# Altium schematic sheet Strain Gauge ADC.SchDoc: SG ADC
size Letter; Date: Jul 31/2018; Revision: 1; SheetNumber: 5; SheetTotal: 9
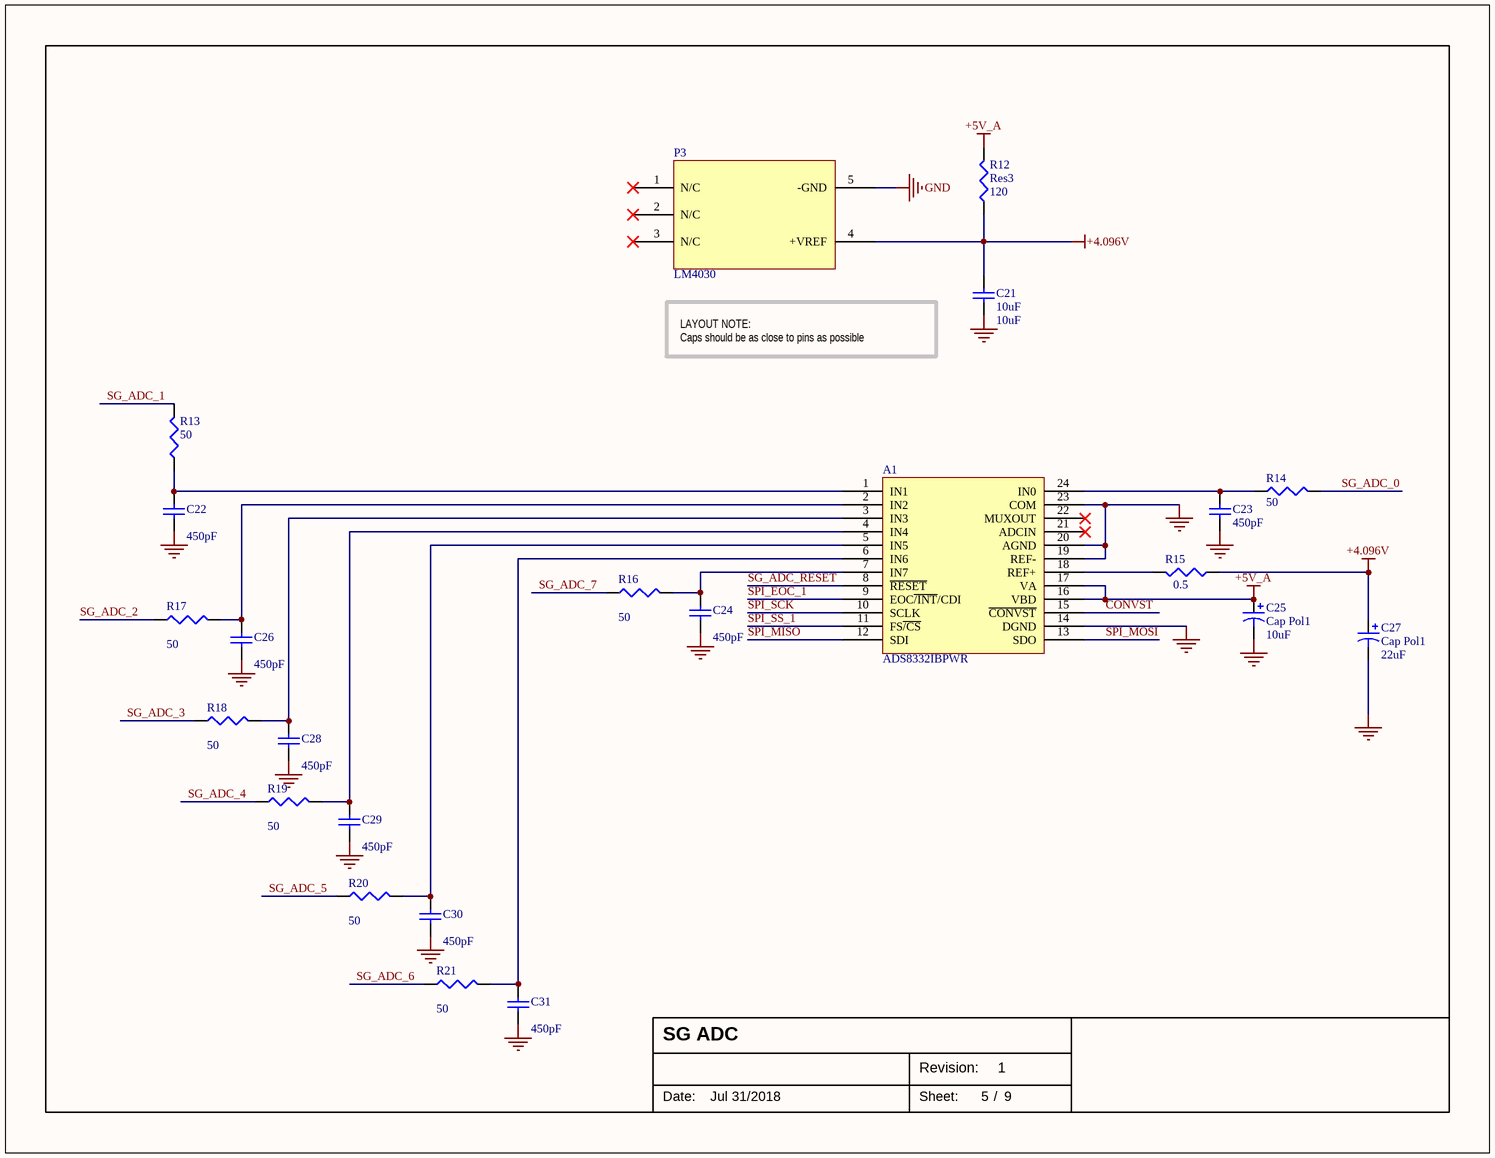
[diagram p0: Strain Gauge ADC.SchDoc]

## Parts
A1  ADS8332IBPWR  [TSSOP-24]
C21  10uF  [1206]
C22  value 450pF  [1206]  (hidden comment: Cap Semi)
C23  value 450pF  [1206]  (hidden comment: Cap Semi)
C24  value 450pF  [1206]  (hidden comment: Cap Semi)
C25  Cap Pol1  value 10uF  [1206-Polarized]
C26  value 450pF  [1206]  (hidden comment: Cap Semi)
C27  Cap Pol1  value 22uF  [1206-Polarized]
C28  value 450pF  [1206]  (hidden comment: Cap Semi)
C29  value 450pF  [1206]  (hidden comment: Cap Semi)
C30  value 450pF  [1206]  (hidden comment: Cap Semi)
C31  value 450pF  [1206]  (hidden comment: Cap Semi)
P3  LM4030  [so-23]
R12  Res3  value 120  [1206]
R13  value 50  [1206]  (hidden comment: Res3)
R14  value 50  [1206]  (hidden comment: Res3)
R15  value 0.5  [1206]  (hidden comment: Res3)
R16  value 50  [1206]  (hidden comment: Res3)
R17  value 50  [1206]  (hidden comment: Res3)
R18  value 50  [1206]  (hidden comment: Res3)
R19  value 50  [1206]  (hidden comment: Res3)
R20  value 50  [1206]  (hidden comment: Res3)
R21  value 50  [1206]  (hidden comment: Res3)

## Nets
+4.096V: C21.2 C27.1 P3.4(+VREF) R12.1 R15.1
+5V_A: A1.16(VBD) A1.17(VA) C25.1 R12.2
GND: A1.14(DGND) A1.19(REF-) A1.20(AGND) A1.23(COM) C21.1 C22.1 C23.1 C24.1 C25.2 C26.1 C27.2 C28.1 C29.1 C30.1 C31.1 P3.5(-GND)
~{CONVST}: A1.15(~{CONVST})
SG_ADC_0: R14.2
SG_ADC_1: R13.2
SG_ADC_2: R17.1
SG_ADC_3: R18.1
SG_ADC_4: R19.1
SG_ADC_5: R20.1
SG_ADC_6: R21.1
SG_ADC_7: R16.1
SG_ADC~{_RESET}: A1.8(~{RESET})
SPI_EOC_1: A1.9(EOC~{/INT}/CDI)
SPI_MISO: A1.12(SDI)
SPI_MOSI: A1.13(SDO)
SPI_SCK: A1.10(SCLK)
SPI_SS_1: A1.11(FS~{/CS})
NetA1_1: A1.1(IN1) C22.2 R13.1
NetA1_2: A1.2(IN2) C26.2 R17.2
NetA1_3: A1.3(IN3) C28.2 R18.2
NetA1_4: A1.4(IN4) C29.2 R19.2
NetA1_5: A1.5(IN5) C30.2 R20.2
NetA1_6: A1.6(IN6) C31.2 R21.2
NetA1_7: A1.7(IN7) C24.2 R16.2
NetA1_18: A1.18(REF+) R15.2
NetA1_24: A1.24(IN0) C23.2 R14.1

Not connected (* = marked no-connect by the designer): A1 21(ADCIN)* 22(MUXOUT)*; P3 1(N/C)* 2(N/C)* 3(N/C)*

## Notes on the sheet
- LAYOUT NOTE:
  Caps should be as close to pins as possible
- Date:
- Revision:
- Sheet:
- /

## Library data of the parts
C21-C24 C26 C28-C31 = Cap Semi: Capacitor (Semiconductor SIM Model); Published: 8-Jun-2000; LatestRevisionDate: 29-May-2009; LatestRevisionNote: IPC-7351 Footprint Added.; PackageReference: C1206; Publisher: Altium Limited; PackageDescription: Chip Capacitor
  C21: Value: 10uF
C25 C27 = Cap Pol1: Polarized Capacitor (Radial); Published: 8-Jun-2000; LatestRevisionDate: 17-Jul-2002; LatestRevisionNote: Re-released for DXP Platform.; PackageReference: RB7.6-15; Publisher: Altium Limited; PackageDescription: Polarized Capacitor (Radial); 2 Leads
R12-R21 = Res3: Resistor; Published: 8-Jun-2000; LatestRevisionDate: 29-May-2009; LatestRevisionNote: IPC-7351 Footprint Added.; PackageReference: J1-0603; Publisher: Altium Limited; PackageDescription: Chip Resistor